# EAGLE schematic Trafo_schematic (EAGLE 9.6.2)
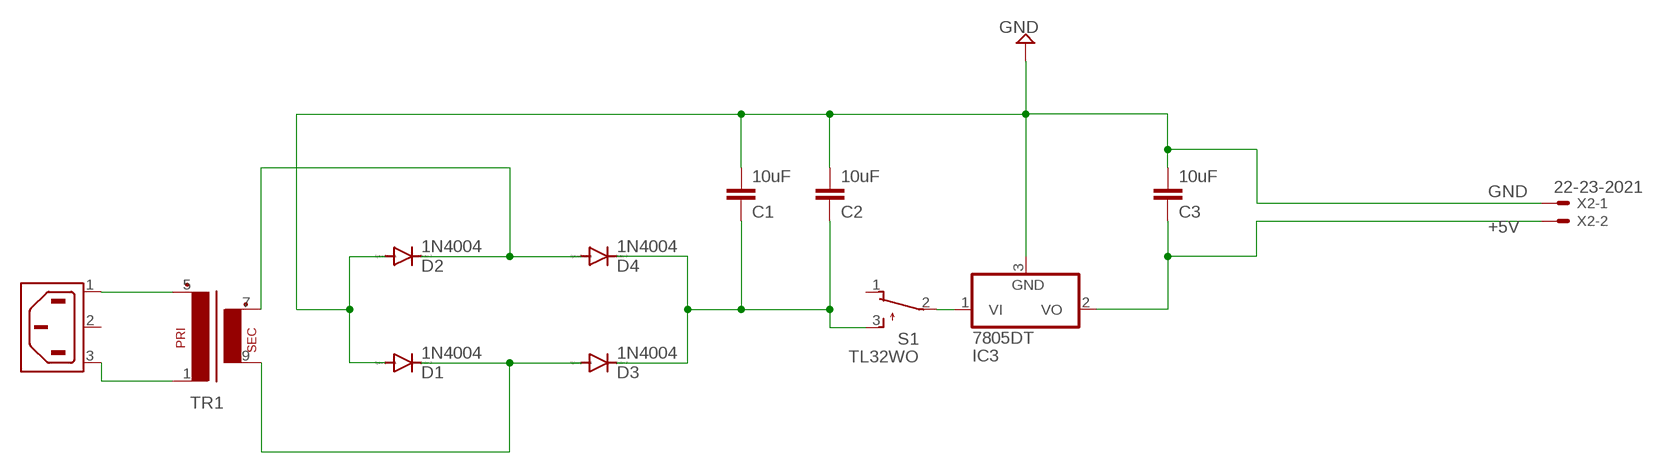
[diagram p0: schematic, sheet 1]

## Parts
C1  10uF  C2.5/2  [C2.5-2]
C2  10uF  C2.5/2  [C2.5-2]
C3  10uF  C2.5/2  [C2.5-2]
D1  1N4004  [DO41-10]
D2  1N4004  [DO41-10]
D3  1N4004  [DO41-10]
D4  1N4004  [DO41-10]
IC3  7805DT  [TO252]
S1  TL32WO  [TL3XWO]
TR1  EI30-1  [EI30-1]
X1  6ESRM-P  [6ESRM-P]
X2  22-23-2021  [22-23-2021]

## Nets
+5V: C3.1 IC3.2(VO) X2.2
GND: C1.2 C2.2 C3.2 D1.A D2.A IC3.3(GND) X2.1
N$47: D1.C D3.A TR1.9(S4)
N$48: D2.C D4.A TR1.7(S3)
N$49: TR1.1 X1.3(AC2)
N$50: TR1.5(P2) X1.1(AC1)
N$52: C1.1 C2.1 D3.C D4.C S1.3(S)
N$59: IC3.1(VI) S1.2(P)
Unconnected: S1.1(O) X1.2(SH)

## Library data of the parts
C1-C3 = capacitor-wima:C: CAPACITOR naming: grid - package width
D1-D4 = diode:1N4004: DIODE general purpose rectifier, 1 A
IC3 = linear:78*: Positive VOLTAGE REGULATOR Source: http://cache.national.com/ds/LM/LM78L05.pdf http://www.fairchildsemi.com/ds/LM/LM7805.pdf
S1 = switch:TL32WO: TINY SWITCH ON - MOM Source: http://www2.produktinfo.conrad.com/datenblaetter/700000-724999/705152-da-01-de-Subminiaturschalter_TL_36WO.pdf
TR1 = trafo:EI30-1: TRANSFORMER 1 primary winding, 1 secondary winding ERA
X1 = con-tycoelectronics:6ESRM-P: AC Connector 120/250 VAC Source: http://catalog.tycoelectronics.com .. ENG_DS_1654001_1099_SR_0406.pdf; MF: TYCO ELECTRONICS; MPN: 6ESRM-P; OC_FARNELL: unknown; OC_NEWARK: 87F1821
X2 = con-molex:22-23-2021: .100" (2.54mm) Center Header - 2 Pin; MF: MOLEX; MPN: 22-23-2021; OC_FARNELL: 1462926; OC_NEWARK: 25C3832